# Altium schematic sheet Sensors.SchDoc: Sensors
size A4; Author: Pedro Trenado & Ignacio Cabrera; DrawnBy: Pedro & Ignacio; SheetNumber: 2; Company: ETSI Telecomunicaciones; Address_City: Madrid; Address_Country: Spain; Address_Phone: 910 67 19 00; Address_State_ZIP: 28040; Address_Street: Av. Complutense, 30; TotalSheet: 5; VersionRevision: V 2.0; Address_Website: https://www.etsist.upm.es; #NAME@: pedro.trenado@alumnos.upm.es; License: Student
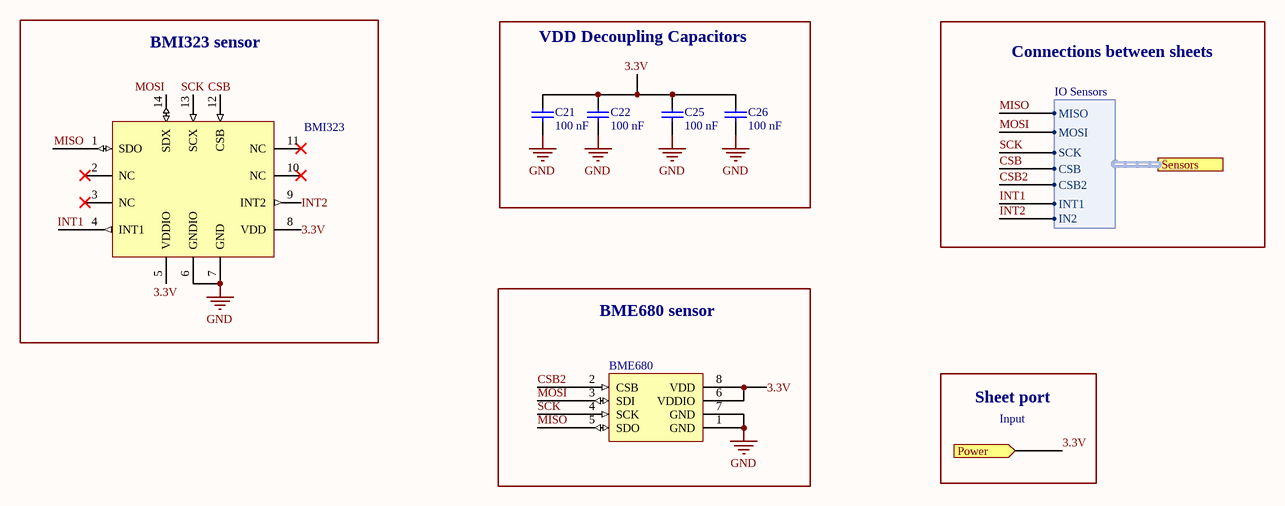
[diagram p0: Sensors.SchDoc]

## Parts
BME  BME680_Sen_4in1  [BME_LGA8]  (value not drawn)
BMI  BMI323  [BMI323]
C21  100 nF  [CAPC1005X55X30LL05T10]
C22  100 nF  [CAPC1005X55X30LL05T10]
C25  100 nF  [CAPC1005X55X30LL05T10]
C26  100 nF  [CAPC1005X55X30LL05T10]

## Blocks framed on the sheet
BMI323 sensor: BMI
VDD Decoupling Capacitors: C21 C22 C25 C26
BME680 sensor: BME

## Ports
Power (in), Sensors (harness IO Sensors)

## Harnesses
IO Sensors: MISO, MOSI, SCK, CSB, CSB2, INT1, IN2

## Nets
GND: BME.1(GND) BME.7(GND) BMI.6(GNDIO) BMI.7(GND) C21.1 C22.1 C25.1 C26.1
3.3V: BME.6(VDDIO) BME.8(VDD) BMI.5(VDDIO) BMI.8(VDD) C21.2 C22.2 C25.2 C26.2 ; port Power
CSB: BMI.12(CSB) ; port Sensors.CSB
CSB2: BME.2(CSB) ; port Sensors.CSB2
INT1: BMI.4(INT1) ; port Sensors.INT1
INT2: BMI.9(INT2) ; port Sensors.IN2
MISO: BME.5(SDO) BMI.1(SDO) ; port Sensors.MISO
MOSI: BME.3(SDI) BMI.14(SDX) ; port Sensors.MOSI
SCK: BME.4(SCK) BMI.13(SCX) ; port Sensors.SCK

Not connected (* = marked no-connect by the designer): BMI 2(NC)* 3(NC)* 10(NC)* 11(NC)*

## Notes on the sheet
- (near BMI) SPI connection between BMI323 and microcontroller.
- Connections between sheets
- (near BME) SPI connection between BME680 and microcontroller.
- Sheet port
- Input
- Title:
- Drawn By:
- Page Contents:
- Checked By:
- Size:
- Date:
- File:
- License:
- Email:
- A4
- Number:
- Time:
- Revision:
- Sheet
- Website:
- of
- (in symbol BME680_Sen_4in1) BME680

## Library data of the parts
BMI = BMI323: Company: ETSI Telecomunicaciones
C21 C22 C25 C26 = CMP-0001-00074-2: Manufacturer: Kemet; Part Number: C0402C104K4RACTU